# EAGLE design Adafruit TLC5947 (EAGLE 6.3)
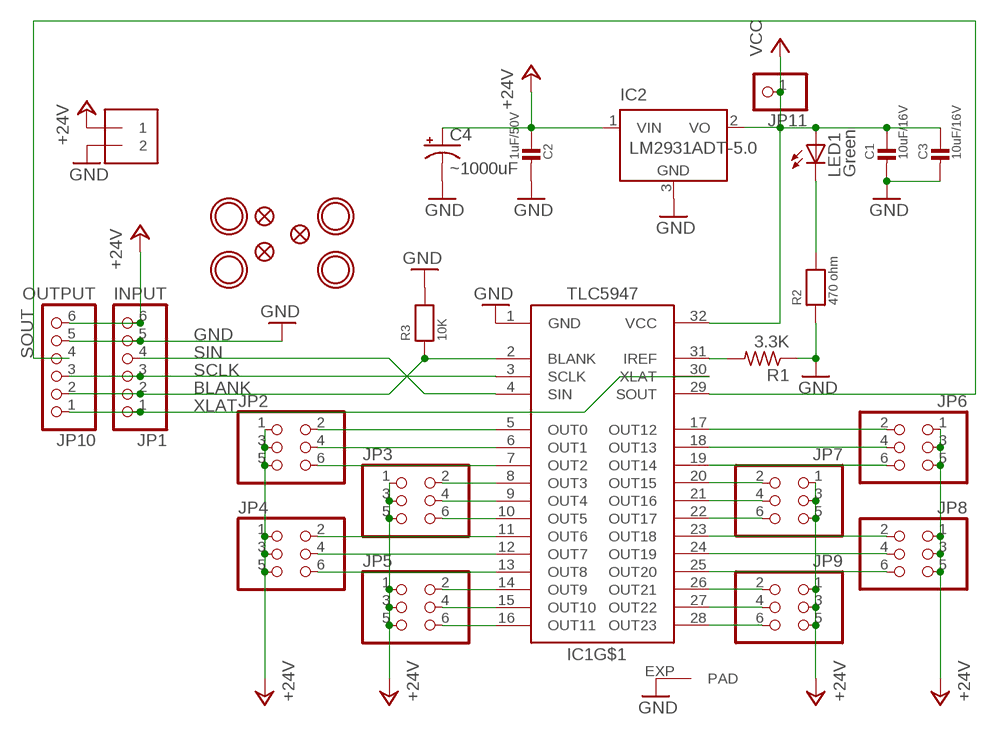
[diagram p0: schematic, sheet 1]

## Parts
C1  10uF/16V  CAP_CERAMIC0805  [0805]
C2  1uF/50V  CAP_CERAMIC0805  [0805]
C3  10uF/16V  CAP_CERAMIC0805  [0805]
C4  ~1000uF  CPOL-USE3.5-8  [E3,5-8]
FID1  FIDUCIAL""  [FIDUCIAL_1MM]
FID2  FIDUCIAL""  [FIDUCIAL_1MM]
FID3  FIDUCIAL""  [FIDUCIAL_1MM]
IC1  TLC5947-DAP  [HTSSOP32DAP]
IC2  LM2931ADT-5.0  LM2936DT-3.3  [TO252]
J1  1X2-3.5MM  [1X2-3.5MM]
JP1  INPUT  PINHD-1X6CB  [1X06-CLEANBIG]
JP2  HEADER-2X3  [2X03_ROUND_70MIL]
JP3  HEADER-2X3  [2X03_ROUND_70MIL]
JP4  HEADER-2X3  [2X03_ROUND_70MIL]
JP5  HEADER-2X3  [2X03_ROUND_70MIL]
JP6  HEADER-2X3  [2X03_ROUND_70MIL]
JP7  HEADER-2X3  [2X03_ROUND_70MIL]
JP8  HEADER-2X3  [2X03_ROUND_70MIL]
JP9  HEADER-2X3  [2X03_ROUND_70MIL]
JP10  OUTPUT  PINHD-1X6CB  [1X06-CLEANBIG]
JP11  PINHD-1X1CB  [1X01-CLEANBIG]
LED1  Green  LEDCHIP-LED0805  [CHIP-LED0805]
R1  3.3K  FLIPFLOP-RES  [0805-THM]
R2  470 ohm  RESISTOR0805  [0805]
R3  10K  RESISTOR0805  [0805]
U$1  MOUNTINGHOLE2.5  [MOUNTINGHOLE_2.5_PLATED]
U$2  MOUNTINGHOLE2.5  [MOUNTINGHOLE_2.5_PLATED]
U$3  MOUNTINGHOLE2.5  [MOUNTINGHOLE_2.5_PLATED]
U$4  MOUNTINGHOLE2.5  [MOUNTINGHOLE_2.5_PLATED]

## Nets
+24V: C2.1 C4.+ IC2.1(VIN) J1.1 JP1.6 JP2.1 JP2.3 JP2.5 JP3.1 JP3.3 JP3.5 JP4.1 JP4.3 JP4.5 JP5.1 JP5.3 JP5.5 JP6.1 JP6.3 JP6.5 JP7.1 JP7.3 JP7.5 JP8.1 JP8.3 JP8.5 JP9.1 JP9.3 JP9.5 JP10.6
BLANK: IC1.2(BLANK) JP1.2 JP10.2 R3.1
GND: C1.2 C2.2 C3.2 C4.- IC1.1(GND) IC1.EXP(PAD) IC2.3(GND) J1.2 JP1.5 JP10.5 R1.1 R2.1 R3.2
N$1: LED1.C R2.2
N$7: IC1.31(IREF) R1.2
N$8: IC1.5(OUT0) JP2.2
N$9: IC1.6(OUT1) JP2.4
N$10: IC1.7(OUT2) JP2.6
N$11: IC1.8(OUT3) JP3.2
N$12: IC1.9(OUT4) JP3.4
N$13: IC1.10(OUT5) JP3.6
N$14: IC1.11(OUT6) JP4.2
N$15: IC1.12(OUT7) JP4.4
N$16: IC1.13(OUT8) JP4.6
N$17: IC1.14(OUT9) JP5.2
N$18: IC1.15(OUT10) JP5.4
N$19: IC1.16(OUT11) JP5.6
N$20: IC1.26(OUT21) JP9.2
N$21: IC1.27(OUT22) JP9.4
N$22: IC1.28(OUT23) JP9.6
N$23: IC1.23(OUT18) JP8.2
N$24: IC1.24(OUT19) JP8.4
N$25: IC1.25(OUT20) JP8.6
N$26: IC1.20(OUT15) JP7.2
N$27: IC1.21(OUT16) JP7.4
N$28: IC1.22(OUT17) JP7.6
N$29: IC1.17(OUT12) JP6.2
N$30: IC1.18(OUT13) JP6.4
N$31: IC1.19(OUT14) JP6.6
SCLK: IC1.3(SCLK) JP1.3 JP10.3
SIN: IC1.4(SIN) JP1.4
SOUT: IC1.29(SOUT) JP10.4
VCC: C1.1 C3.1 IC1.32(VCC) IC2.2(VO) JP11.1 LED1.A
XLAT: IC1.30(XLAT) JP1.1 JP10.1

## Library data of the parts
C1-C3 = microbuilder:CAP_CERAMIC: Ceramic Capacitors For new designs, use the packages preceded by an '_' character since they are more reliable: The following footprints should be used on most boards: _0402 - Standard footprint for regular board layouts _0603 - Standard footprint for regular board layouts _0805 - Standard footprint for regular board layouts For extremely tight-pitch boards where space is at a premium, the following 'micro-pitch' footprints can be used (smaller pads, no silkscreen outline, etc.): _0402MP - Micro-pitch footprint for very dense/compact boards _0603MP - Micro-pitch footprint for very dense/compact boards _0805MP - Micro-pitch footprint for very dense/compact boards Commonly Stocked Parts 0402 - 0402 Surface Mount Capacitors 16pF 50V 5% [Digikey: 445-4899-2-ND] 18pF 50V 5% [Digikey: 490-1281-2-ND] 22pF 50V 5% [Digikey: 490-1283-2-ND] 68pF 50V 5% [Digikey: 490-1289-2-ND] 0.1uF 10V 10% [Digikey: 490-1318-2-ND] 1.0uF 6.3V 10% [Digikey: 490-1320-2-ND] 0603 - 0603 Surface Mount Capacitors 16 pF 50V 5% [Digikey: 445-5051-2-ND] 22 pF 50V [Digikey: PCC220ACVTR-ND] 33 pF 50V 5% [Digikey: 490-1415-1-ND] 56pF 50V 5% [Digikey: 490-1421-1-ND] 220pF 50V 5% [Digikey: 445-1285-1-ND] 680 pF 50V 2200 pF 50V 5% C0G [Digikey: 445-1297-1-ND] 5600 pF 100V 5% X7R [Digikey: 478-3711-1-ND] 0.1 µF 25V 10% [Digikey: PCC2277TR-ND] 0.22 µF 16V 10% X7R [Digikey: 445-1318-1-ND] 1.0 µF 25V 10% [Digikey: 445-5146-2-ND] 0603 - RF Specific 3pF 250V +/-0.1pF RF [Digikey: 712-1347-1-ND] 18 pF 250V 5% [Digikey: 478-3505-1-ND or 712-1322-1-ND] 56 pF 250V 5% C0G RF [Digikey: 490-4867-1-ND] 68 pF 250V RF [Digikey: 490-4868-1-ND] 0805 - 0805 Surface Mount Capacitors 220 pF 250V 2% RF Ceramic Capacitor [Digikey: 712-1398-1-ND] 1000 pF 50V 2% NP0 Ceramic Capacitor [Digikey: 478-3760-1-ND] 0.1 µF 25V 10% Ceramic Capacitor [Digikey: PCC1828TR-ND] 1.0 µF 16V 10% Ceramic Capacitor[Digikey: 490-1691-2-ND] 10.0 µF 10V 10% Ceramic Capacitor[Digikey: 709-1228-1-ND] 10.0 uF 16V 10% Ceramic Capacitor [Digikey: 478-5165-2-ND] 47 uF 6.3V 20% Ceramic Capacitor [Digikey: 587-1779-1-ND or 399-5506-1-ND] 1206 - 1206 Surface Mount Capacitors 47uF 10V 20% Ceramic Capacitor [Digikey: 490-5528-1-ND or 399-5508-1-ND or 445-6010-1-ND] 100uF 6.3V -20%, +80% Y5V Ceramic Capacitor (Digikey: 490-4512-1-ND, Mouser: 81-GRM31CF50J107ZE1L)
C4 = adafruit:CPOL-US: POLARIZED CAPACITOR, American symbol
FID1-FID3 = microbuilder:FIDUCIAL: Fiducial Alignment Points Various fiducial points for machine vision alignment.; BOM: EXCLUDE
IC1 = adafruit:TLC5947
IC2 = national-semiconductor:LM2936?*: Ultra-Low Quiescent Current LDO Voltage Regulator Source: Data sheet <http://www.national.com/ds/LM/LM2936.pdf>; MPN: LM2936DT-3.3.; OC_FARNELL: 1286863; OC_NEWARK: 26M0361
J1 = adafruit:1X2: 3.5mm Terminal block http://www.ladyada.net/library/pcb/eaglelibrary.html
JP1 JP10 = adafruit:PINHD-1X6: PIN HEADER
JP2-JP9 = microbuilder:HEADER-2X3: PIN HEADER
JP11 = adafruit:PINHD-1X1: Pin header 1x1 for 0.1" spacing With round pins
LED1 = adafruit:LED: LED OSRAM: - CHIPLED LG R971, LG N971, LY N971, LG Q971, LY Q971, LO R971, LY R971 LH N974, LH R974 LS Q976, LO Q976, LY Q976 LO Q996 - Hyper CHIPLED LW Q18S LB Q993, LB Q99A, LB R99A - SideLED LS A670, LO A670, LY A670, LG A670, LP A670 LB A673, LV A673, LT A673, LW A673 LH A674 LY A675 LS A676, LA A676, LO A676, LY A676, LW A676 LS A679, LY A679, LG A679 - Hyper Micro SIDELED® LS Y876, LA Y876, LO Y876, LY Y876 LT Y87S - SmartLED LW L88C, LW L88S LB L89C, LB L89S, LG L890 LS L89K, LO L89K, LY L89K LS L896, LA L896, LO L896, LY L896 - TOPLED LS T670, LO T670, LY T670, LG T670, LP T670 LSG T670, LSP T670, LSY T670, LOP T670, LYG T670 LG T671, LOG T671, LSG T671 LB T673, LV T673, LT T673, LW T673 LH T674 LS T676, LA T676, LO T676, LY T676, LB T676, LH T676, LSB T676, LW T676 LB T67C, LV T67C, LT T67C, LS T67K, LO T67K, LY T67K, LW E67C LS E67B, LA E67B, LO E67B, LY E67B, LB E67C, LV E67C, LT E67C LW T67C LS T679, LY T679, LG T679 LS T770, LO T770, LY T770, LG T770, LP T770 LB T773, LV T773, LT T773, LW T773 LH T774 LS E675, LA E675, LY E675, LS T675 LS T776, LA T776, LO T776, LY T776, LB T776 LHGB T686 LT T68C, LB T68C - Hyper Mini TOPLED® LB M676 - Mini TOPLED Santana® LG M470 LS M47K, LO M47K, LY M47K Source: http://www.osram.convergy.de/
R1 = adafruit:FLIPFLOP-RES: Flip Flop resistor An 0805 resistor inside a standard 1/4W 5% resistor. Makes for easy mods
R2 R3 = microbuilder:RESISTOR: Resistors For new designs, use the packages preceded by an '_' character since they are more reliable: The following footprints should be used on most boards: _0402 - Standard footprint for regular board layouts _0603 - Standard footprint for regular board layouts _0805 - Standard footprint for regular board layouts For extremely tight-pitch boards where space is at a premium, the following 'micro-pitch' footprints can be used (smaller pads, no silkscreen outline, etc.): _0402MP - Micro-pitch footprint for very dense/compact boards _0603MP - Micro-pitch footprint for very dense/compact boards _0805MP - Micro-pitch footprint for very dense/compact boards
U$1-U$4 = microbuilder:MOUNTINGHOLE: Mounting Hole For #2 screws (0.086"/2.18mm width, 0.094"/2.4mm hole) use 2.5mm

## Board
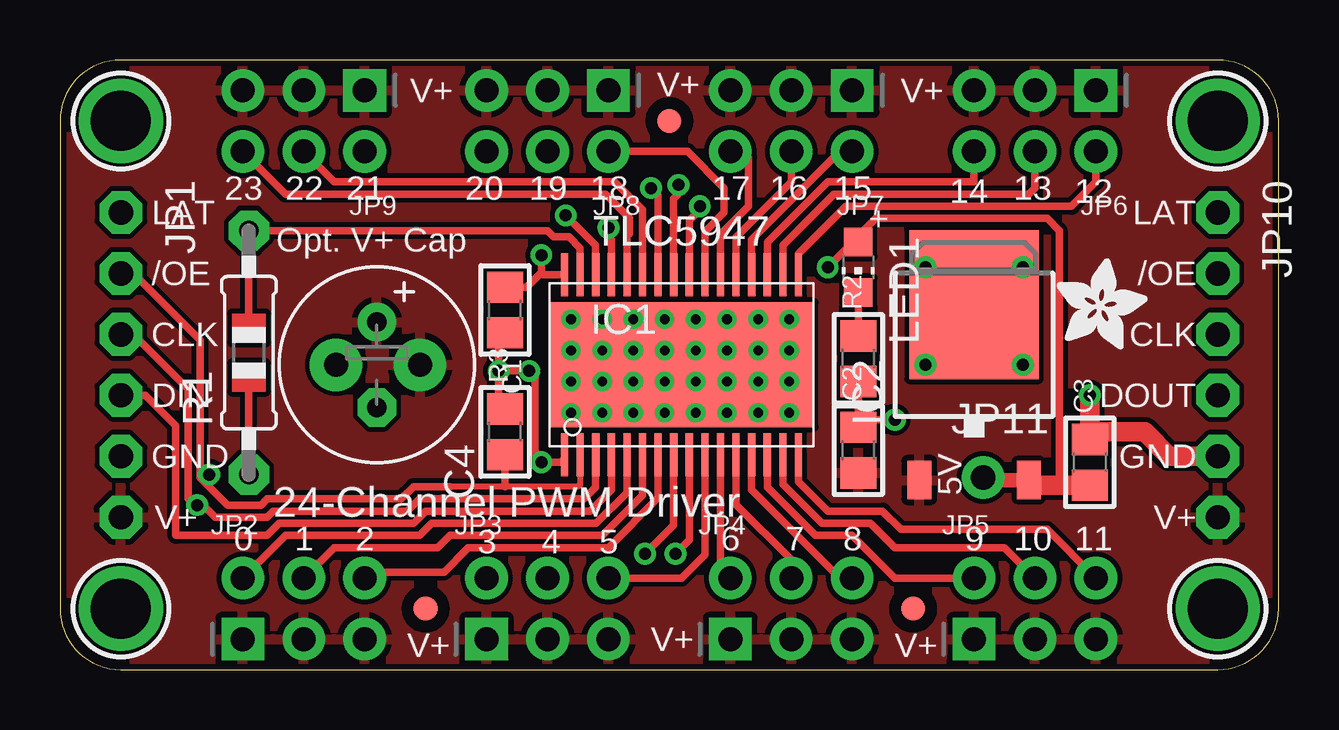
[diagram p1: board, top side]
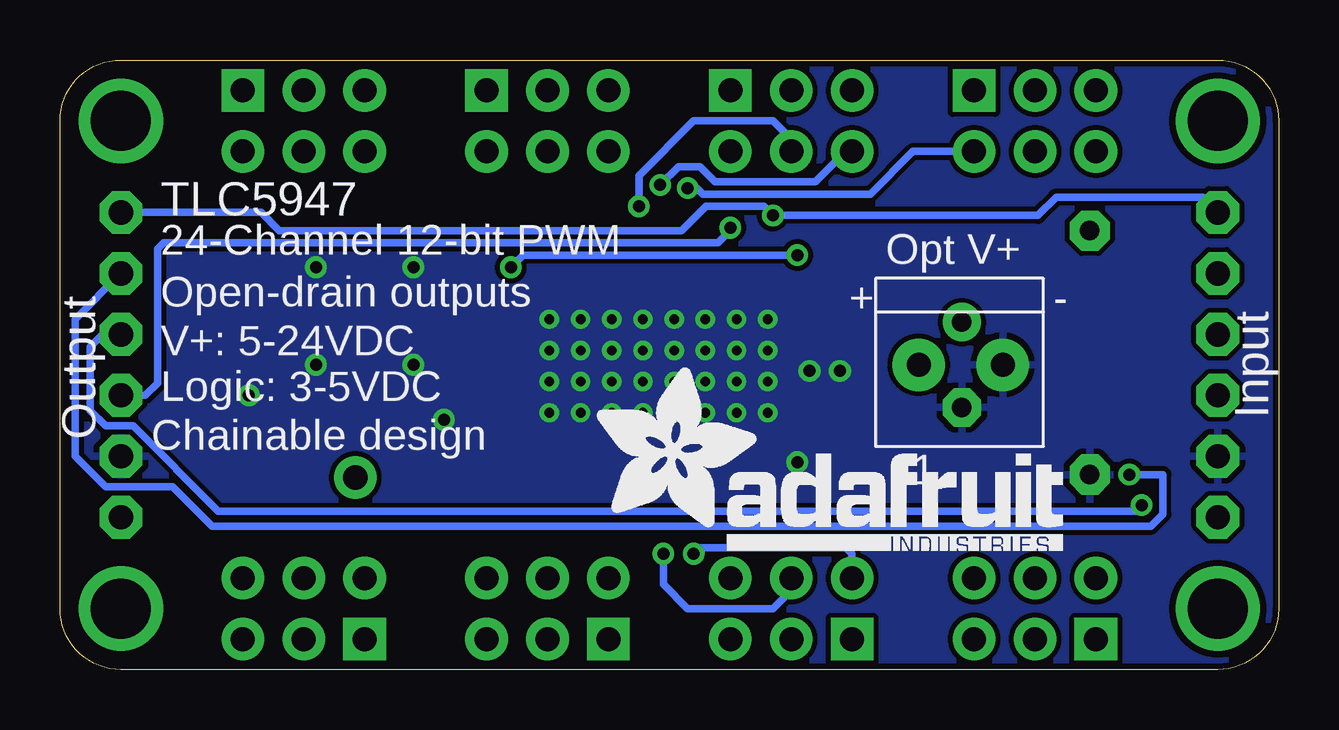
[diagram p2: board, bottom side, seen from below]

Size 50.8 x 25.4 mm. Coordinates in mm from the lower left corner, seen from the top.
Outline: 50.8,2.54 50.8,22.86 arc90 48.26,25.4 2.54,25.4 arc90 0,22.86 0,2.54 arc90 2.54,0 48.26,0 arc90 50.8,2.54
Copper layers (1*16): Top 0.035mm / dielectric 1.5mm / Bottom 0.035mm
Design rules "adafruit *": minimum track width 8mil, minimum drill 15.5mil, track to track 8mil, track to pad 8mil, pad to pad 8mil, via to via 8mil, smd to smd 8mil, copper to edge 10mil, drill to drill 8mil, minimum pad ring 10mil, minimum via ring 8mil, stop-mask expansion 4mil, vias tented up to drill 20mil, thermal gap 10mil

### Footprints (pad centres in the part's own frame; a part is rotated, then mirrored left to right if it is on the bottom)
0805 = smd 1.3 x 1.5: 1 -0.95,0; 2 0.95,0
E3,5-8 = drill 0.813 pad 1.6: + -1.778,0 | drill 0.813 pad 1.6 octagon: - 1.778,0
FIDUCIAL_1MM = smd 1 x 1: 1 0,0
HTSSOP32DAP = smd 0.3 x 1.8: 1 -4.875,-3.75; 2 -4.225,-3.75; 3 -3.575,-3.75; 4 -2.925,-3.75; 5 -2.275,-3.75; 6 -1.625,-3.75; 7 -0.975,-3.75; 8 -0.325,-3.75; 9 0.325,-3.75; 10 0.975,-3.75; 11 1.625,-3.75; 12 2.275,-3.75; 13 2.925,-3.75; 14 3.575,-3.75; 15 4.225,-3.75; 16 4.875,-3.75; 17 4.875,3.75; 18 4.225,3.75; 19 3.575,3.75; 20 2.925,3.75; 21 2.275,3.75; 22 1.625,3.75; 23 0.975,3.75; 24 0.325,3.75; 25 -0.325,3.75; 26 -0.975,3.75; 27 -1.625,3.75; 28 -2.275,3.75; 29 -2.925,3.75; 30 -3.575,3.75; 31 -4.225,3.75; 32 -4.875,3.75 | smd 11 x 5.2: EXP 0,0
TO252 = smd 1 x 1.6: 1 -2.28,-4.8; 2 2.28,-4.8 | smd 5.4 x 6.2: 3 0,2.5
1X2-3.5MM = drill 1 pad 2.184: 1 1.8,0; 2 -1.7,0
1X06-CLEANBIG = drill 1.016 pad 1.778 octagon: 1 -6.35,0; 2 -3.81,0; 3 -1.27,0; 4 1.27,0; 5 3.81,0; 6 6.35,0
2X03_ROUND_70MIL = drill 1 pad 1.778 square: 1 -2.54,-1.27 | drill 1 pad 1.778: 2 -2.54,1.27; 3 0,-1.27; 4 0,1.27; 5 2.54,-1.27; 6 2.54,1.27
1X01-CLEANBIG = drill 1.016 pad 1.778: 1 0,0
CHIP-LED0805 = smd 1.2 x 1.2: A 0,-1.05; C 0,1.05
0805-THM = drill 0.813 pad 1.676 octagon: 1 -5.08,0; 2 5.08,0
MOUNTINGHOLE_2.5_PLATED = drill 2.5 pad 3.2: P$1 0,0

### Placement (x,y rotation side)
C1  18.54,14.99 270 top
C2  33.27,9.14 90 top
C3  42.93,8.64 90 top
C4  13.21,12.7 270 top
FID1  15.24,2.54 0 top
FID2  25.4,22.86 0 top
FID3  35.56,2.54 0 top
IC1  25.91,12.7 0 top
IC2  38.1,12.7 0 top
J1  13.21,12.7 180 bottom
JP1  2.54,12.7 270 top
JP2  10.16,2.54 0 top
JP3  20.32,2.54 0 top
JP4  30.48,2.54 0 top
JP5  40.64,2.54 0 top
JP6  40.64,22.86 180 top
JP7  30.48,22.86 180 top
JP8  20.32,22.86 180 top
JP9  10.16,22.86 180 top
JP10  48.26,12.7 270 top
JP11  38.48,8 0 top
LED1  33.27,16.76 180 top
R1  7.87,13.21 90 top
R2  33.27,12.95 90 top
R3  18.54,9.91 90 top
U$1  2.54,22.86 0 top
U$2  48.26,22.86 0 top
U$3  2.54,2.54 0 top
U$4  48.26,2.54 0 top
U$5  [ADAFRUIT_TEXT_20MM]  28.57,4.95 0 bottom
U$6  [ADAFRUIT_3.5MM]  41.53,13.34 0 top

### Tracks (layer width: path | path; a pad name or v marks a point on that pad's centre or on a via)
+24V
  pour Top: 50.8,0 0,0 0,25.4 50.8,25.4
BLANK  (via drill 0.5)
  Top 0.254: IC1.2 21.68,7.71 21.59,7.62 18.54,7.62 16.26,7.62
  Top 0.305: R3.1 18.54,7.62 | 16.26,7.62 14.73,7.62 14.22,7.11 8.64,7.11 8.38,6.86 6.99,6.86 5.84,8 5.84,8.13 | 5.84,8.13 5.84,13.72 3.05,16.51 JP1.2 | v6.22,8.13 5.84,8.13
  Bottom 0.305: JP10.2 50.16,14.61 50.16,8.89 48.9,7.62 46.1,7.62 44.45,5.97 5.33,5.97 4.83,6.48 4.83,8.13 v6.22,8.13
GND  (via drill 0.4, 0.5)
  Top 0.305: v18.29,12.45 v19.56,12.45 19.81,12.45 19.81,8.89 v20.07,8.64 20.82,8.64 arc90 IC1.1 | 33.72,12 R2.1 C2.2 33.59,10.41 v34.8,10.41 | v36.07,16.76 36.28,16.76 36.28,15.2 IC2.3 | v26.5,13.3 26.5,13.09 26.15,12.75 25.95,12.75 IC1.EXP | C1.2 18.29,13.78 v18.29,12.45 | R3.2 18.29,11.11 v18.29,12.45 | 43.11,9.91 43.11,9.59 C3.2
  Top 0.813: 38.1,14.92 IC2.3 | JP10.5 46.23,8.89 45.21,9.91 43.11,9.91 42.93,10.09 v42.93,11.43
  other vias: 40.13,12.7 36.07,12.7 40.13,16.76 21.3,14.6 21.3,13.3 21.3,12 21.3,10.7 22.6,14.6 22.6,13.3 22.6,12 22.6,10.7 23.9,14.6 23.9,13.3 23.9,12 23.9,10.7 25.2,14.6 25.2,13.3 25.2,12 25.2,10.7 26.5,14.6 26.5,12 26.5,10.7 27.8,14.6 27.8,13.3 27.8,12 27.8,10.7 29.1,14.6 29.1,13.3 29.1,12 30.4,14.6 30.4,13.3 30.4,12 30.4,10.7 29.1,10.7
  pour Bottom: 50.8,0 50.8,25.4 0,25.4 0,0
N$1
  Top 0.305: R2.2 LED1.C
N$7
  Top 0.305: IC1.31 21.68,17.56 21.21,18.03 20.57,18.03 20.32,18.29 R1.2
N$8
  Top 0.305: IC1.5 23.63,7.38 22.35,6.1 15.49,6.1 14.99,5.59 9.4,5.59 JP2.2
N$9
  Top 0.305: IC1.6 24.28,7.26 22.61,5.59 16.26,5.59 15.75,5.08 11.43,5.08 JP2.4
N$10
  Top 0.305: IC1.7 24.93,7.15 22.86,5.08 17.02,5.08 16,4.06 12.95,4.06 JP2.6
N$11  (via drill 0.5)
  Top 0.305: IC1.8 25.58,6.03 v24.38,4.83
  Bottom 0.305: v24.38,4.83 24.13,5.08 18.03,5.08 17.78,4.83 JP3.2
N$12  (via drill 0.5)
  Top 0.305: IC1.9 26.23,5.41 v25.65,4.83
  Bottom 0.305: v25.65,4.83 25.65,3.56 24.64,2.54 21.08,2.54 20.32,3.3 JP3.4
N$13
  Top 0.305: IC1.10 26.88,4.79 25.91,3.81 JP3.6
N$14
  Top 0.305: IC1.11 27.53,4.22 JP4.2
N$15
  Top 0.305: IC1.12 28.18,6.87 30.48,4.57 JP4.4
N$16
  Top 0.305: IC1.13 28.83,7.49 32.51,3.81 JP4.6
N$17
  Top 0.305: IC1.14 29.48,7.6 31.5,5.59 33.02,5.59 34.8,3.81 JP5.2
N$18
  Top 0.305: IC1.15 30.13,7.71 31.75,6.1 33.78,6.1 34.8,5.08 39.37,5.08 JP5.4
N$19
  Top 0.305: IC1.16 30.78,7.83 32,6.6 34.29,6.6 35.05,5.84 41.15,5.84 JP5.6
N$20  (via drill 0.5)
  Top 0.305: IC1.26 24.93,19.77 v24.64,20.07
  Bottom 0.305: v24.64,20.07 24.26,20.07 24,19.81 17.02,19.81 15.24,21.59 JP9.2
N$21
  Top 0.305: IC1.27 24.28,19.15 23.11,20.32 11.43,20.32 JP9.4
N$22
  Top 0.305: JP9.6 9.4,19.81 22.73,19.81 23.75,18.8 23.75,18.16 23.63,18.05 IC1.28
N$23
  Top 0.305: JP8.2 26.16,21.59 27.69,20.07 27.69,19.05 26.88,18.25 IC1.23
N$24  (via drill 0.5)
  Top 0.305: IC1.24 26.23,18.73 26.67,19.16 v26.67,19.3
  Bottom 0.305: v26.67,19.3 26.67,20.57 24.38,22.86 21.08,22.86 20.32,22.1 JP8.4
N$25  (via drill 0.5)
  Top 0.305: IC1.25 25.58,19.63 25.78,19.83 v25.78,20.19
  Bottom 0.305: v25.78,20.19 25.02,20.95 24.13,20.95 23.5,20.32 19.3,20.32 18.03,21.59 JP8.6
N$26
  Top 0.305: IC1.20 28.83,17.91 32.51,21.59 JP7.2
N$27
  Top 0.305: IC1.21 28.18,18.02 30.48,20.32 JP7.4
N$28
  Top 0.305: IC1.22 27.53,18.14 28.7,19.3 28.7,21.34 28.45,21.59 JP7.6
N$29
  Top 0.305: JP6.2 43.18,20.32 42.16,19.3 32.77,19.3 30.78,17.32 IC1.17
N$30
  Top 0.305: JP6.4 40.64,20.07 40.39,19.81 32.26,19.81 30.13,17.69 IC1.18
N$31
  Top 0.305: JP6.6 38.1,20.32 32,20.32 29.48,17.8 IC1.19
SCLK  (via drill 0.5)
  Top 0.305: IC1.3 22.33,7.6 21.84,7.11 14.99,7.11 14.48,6.6 8.89,6.6 8.64,6.35 6.48,6.35 5.97,6.86 v5.71,6.86 5.59,6.86 5.33,7.11 5.33,11.68 3.05,13.97 JP1.3
  Bottom 0.305: v5.71,6.86 5.97,6.6 44.2,6.6 47.75,10.16 48.9,10.16 49.53,10.79 49.53,13.46 49.02,13.97 JP10.3
SIN
  Top 0.305: IC1.4 22.98,7.49 22.1,6.6 15.24,6.6 14.73,6.1 9.14,6.1 8.64,5.59 4.83,5.59 4.83,10.16 3.56,11.43 JP1.4
SOUT  (via drill 0.5)
  Top 0.305: IC1.29 22.98,17.91 22.86,18.03 v22.86,18.41
  Bottom 0.305: v22.86,18.41 22.86,18.29 23.37,17.78 46.48,17.78 46.74,17.53 46.74,11.94 47.24,11.43 JP10.4
VCC  (via drill 0.5)
  Top 0.305: 20.07,16.55 v20.07,17.27 | v32,16.76 33.05,17.81 LED1.A 33.27,18.07 34,18.8 41.15,18.8 41.66,18.29 41.66,7.69 41.27,7.69 | 20.07,16.55 19.45,15.94 C1.1 | 20.07,16.55 20.17,16.45 IC1.32
  Top 0.61: JP11.1 38.58,7.9 IC2.2
  Top 0.813: IC2.2 40.59,7.69 41.27,7.69 C3.1
  Bottom 0.305: v20.07,17.27 31.5,17.27 v32,16.76
XLAT  (via drill 0.5)
  Top 0.305: v21.08,18.92 22.33,17.67 IC1.30
  Bottom 0.305: JP10.1 42.42,19.05 41.66,18.29 24.89,18.29 23.88,19.3 21.46,19.3 v21.08,18.92 10.03,18.92 9.27,19.68 3.17,19.68 JP1.1

### Text on the board
tPlace: V+ | V+ | V+ | 23 | 22 | 21 | 20 | 19 | 18 | 17 | 16 | 15 | 13 | LAT | LAT | 14 | 12 | TLC5947 | Opt. V+ Cap | /OE | /OE | CLK | CLK | DOUT | DIN | 5V | GND | GND | V+ | V+ | 24-Channel PWM Driver | 0 | 1 | 2 | 3 | 4 | 5 | 6 | 7 | 8 | 9 | 10 | 11 | V+ | V+ | V+
bPlace: TLC5947 | Opt V+ | 24-Channel 12-bit PWM | - | + | Open-drain outputs | Input | V+: 5-24VDC | Output | Logic: 3-5VDC | Chainable design